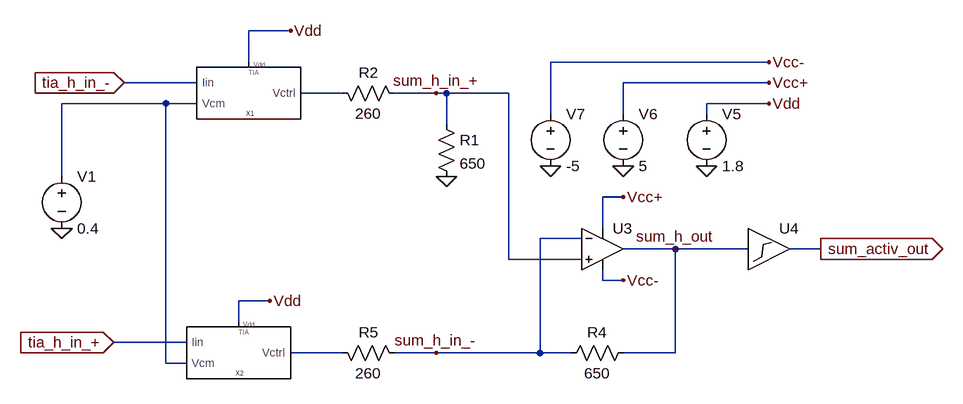
[diagram p0: schematic column_activ_tia_relu.asc]
column_activ_tia_relu.asc, the LTspice schematic file:
Version 4
SHEET 1 2360 680
WIRE 336 -32 272 -32
WIRE 272 16 272 -32
WIRE 1072 16 736 16
WIRE 192 48 80 48
WIRE 1072 48 848 48
WIRE 416 64 352 64
WIRE 560 64 496 64
WIRE 576 64 560 64
WIRE 672 64 576 64
WIRE 144 80 -16 80
WIRE 192 80 144 80
WIRE 1072 80 976 80
WIRE 736 96 736 16
WIRE 848 96 848 48
WIRE 976 96 976 80
WIRE 576 112 576 64
WIRE -16 192 -16 80
WIRE 848 224 816 224
WIRE 816 272 816 224
WIRE 784 288 720 288
WIRE 928 304 848 304
WIRE 1040 304 928 304
WIRE 1152 304 1104 304
WIRE 672 320 672 64
WIRE 784 320 672 320
WIRE 816 352 816 336
WIRE 848 352 816 352
WIRE 304 384 256 384
WIRE 256 416 256 384
WIRE 176 448 64 448
WIRE 416 464 336 464
WIRE 560 464 496 464
WIRE 720 464 720 288
WIRE 720 464 560 464
WIRE 768 464 720 464
WIRE 928 464 928 304
WIRE 928 464 848 464
WIRE 144 480 144 80
WIRE 176 480 144 480
FLAG 576 192 0
FLAG 560 64 sum_h_in_+
FLAG 976 176 0
FLAG 848 176 0
FLAG 736 176 0
FLAG 1072 16 Vcc-
FLAG 1072 48 Vcc+
FLAG 1072 80 Vdd
FLAG 560 464 sum_h_in_-
FLAG 848 352 Vcc-
FLAG 848 224 Vcc+
FLAG 928 304 sum_h_out
FLAG 64 448 tia_h_in_+
IOPIN 64 448 In
FLAG 80 48 tia_h_in_-
IOPIN 80 48 In
FLAG 1152 304 sum_activ_out
IOPIN 1152 304 Out
FLAG 336 -32 Vdd
FLAG 304 384 Vdd
FLAG -16 272 0
SYMBOL res 560 96 R0
SYMATTR InstName R1
SYMATTR Value 650
SYMBOL res 512 80 M270
WINDOW 0 32 56 VTop 2
WINDOW 3 0 56 VBottom 2
SYMATTR InstName R2
SYMATTR Value 260
SYMBOL voltage 976 80 R0
WINDOW 123 0 0 Left 0
WINDOW 39 0 0 Left 0
SYMATTR InstName V5
SYMATTR Value 1.8
SYMBOL voltage 848 80 R0
WINDOW 123 0 0 Left 0
WINDOW 39 0 0 Left 0
SYMATTR InstName V6
SYMATTR Value 5
SYMBOL voltage 736 80 R0
WINDOW 123 0 0 Left 0
WINDOW 39 0 0 Left 0
SYMATTR InstName V7
SYMATTR Value -5
SYMBOL res 864 448 R90
WINDOW 0 0 56 VBottom 2
WINDOW 3 32 56 VTop 2
SYMATTR InstName R4
SYMATTR Value 650
SYMBOL res 512 480 M270
WINDOW 0 32 56 VTop 2
WINDOW 3 0 56 VBottom 2
SYMATTR InstName R5
SYMATTR Value 260
SYMBOL OpAmps\\opamp2 816 240 R0
WINDOW 3 16 96 Invisible 2
SYMATTR Value ""
SYMATTR InstName U3
SYMATTR SpiceModel MAX4223
SYMBOL activ 1072 240 R0
WINDOW 3 10 86 Invisible 2
SYMATTR Value ""
SYMATTR InstName U4
SYMATTR SpiceModel ReLU
SYMBOL tia_sch_v0 272 64 R0
SYMATTR InstName X1
SYMBOL tia_sch_v0 256 464 R0
SYMATTR InstName X2
SYMBOL voltage -16 176 R0
WINDOW 123 0 0 Left 0
WINDOW 39 0 0 Left 0
SYMATTR InstName V1
SYMATTR Value 0.4

The netlist it stands for:
* column_activ_tia_relu.asc
R1 sum_h_in_+ 0 650
R2 sum_h_in_+ N001 260
V5 Vdd 0 1.8
V6 Vcc+ 0 5
V7 Vcc- 0 -5
R4 sum_h_out sum_h_in_- 650
R5 sum_h_in_- N003 260
XU3 sum_h_in_+ sum_h_in_- Vcc+ Vcc- sum_h_out MAX4223  ; pins In+ In- V+ V- OUT
XU4 sum_h_out sum_activ_out ReLU  ; pins In OUT
XX1 tia_h_in_- N002 N001 Vdd tia_sch_v0  ; pins Iin Vcm Vctrl Vdd
XX2 tia_h_in_+ N002 N003 Vdd tia_sch_v0  ; pins Iin Vcm Vctrl Vdd
V1 N002 0 0.4
.backanno
.end